# Altium schematic sheet SDcard_eMMC.SchDoc: SDcard_eMMC
size A3; Date: Not used; ApprovedBy: Not used; CheckedBy: Not used; Author: Not used; CompanyName: STMicroelectronics; DrawnBy: Not used; Engineer: Not used; Organization: Not used; Address1: Not used; Address2: Not used; Address3: Not used; Address4: Not used; DocumentNumber: Not used; Revision: Not used; SheetNumber: 13; SheetTotal: 18; CurrentTime: Not used; CurrentDate: Not used; Time: Not used; DocumentFullPathAndName: Not used; DocumentName: Not used; ModifiedDate: Not used; ImagePath: Not used; ProjectName: Not used; Application_BuildNumber: Not used
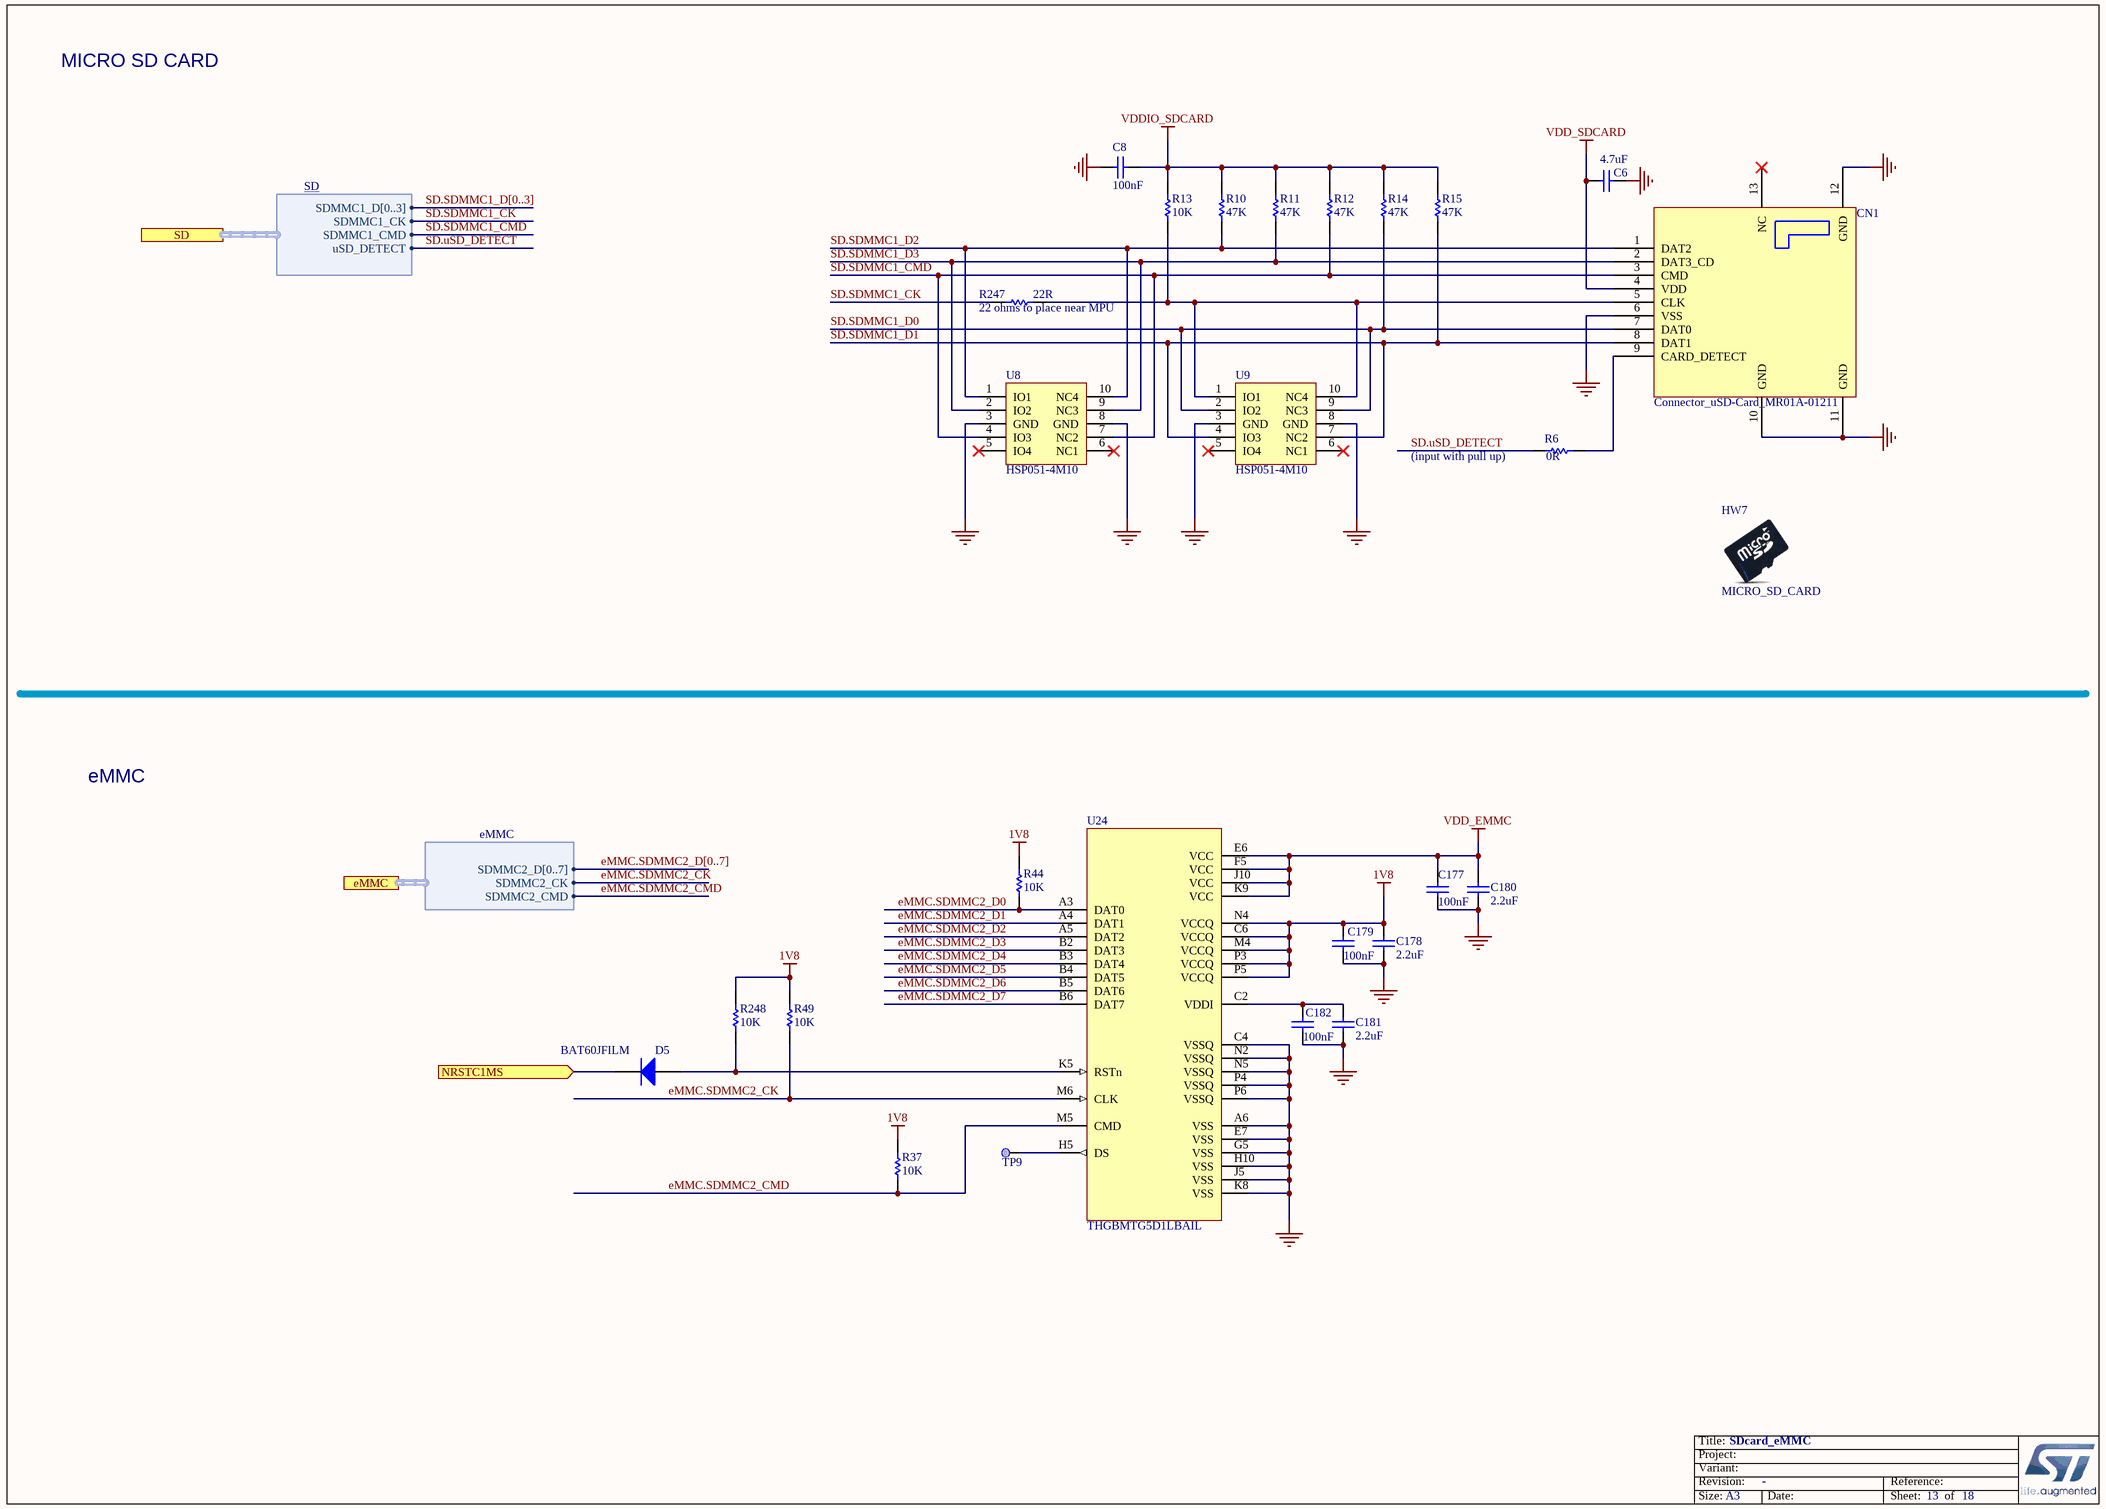
[diagram p0: SDcard_eMMC.SchDoc]

## Parts
C6  value 4.7uF  [C0402]  (hidden comment: Capacitor)
C8  value 100nF  [C0402]  (hidden comment: Capacitor)
C177  value 100nF  [C0402]  (hidden comment: Capacitor)
C178  value 2.2uF  [C0402]  (hidden comment: Capacitor)
C179  value 100nF  [C0402]  (hidden comment: Capacitor)
C180  value 2.2uF  [C0402]  (hidden comment: Capacitor)
C181  value 2.2uF  [C0402]  (hidden comment: Capacitor)
C182  value 100nF  [C0402]  (hidden comment: Capacitor)
CN1  value Connector_uSD-Card_MR01A-01211  [CON_MICROSD_ATOM_MR01A-01211]  (hidden comment: MR01A-01211)
D5  BAT60JFILM  [DIO_SOD323]
HW7  Micro_SD_card  (mechanical)
R6  value 0R  [R0402]  (hidden comment: Resistor)
R10  value 47K  [R0402]  (hidden comment: Resistor)
R11  value 47K  [R0402]  (hidden comment: Resistor)
R12  value 47K  [R0402]  (hidden comment: Resistor)
R13  value 10K  [R0402]  (hidden comment: Resistor)
R14  value 47K  [R0402]  (hidden comment: Resistor)
R15  value 47K  [R0402]  (hidden comment: Resistor)
R37  value 10K  [R0402]  (hidden comment: Resistor)
R44  value 10K  [R0402]  (hidden comment: Resistor)
R49  value 10K  [R0402]  (hidden comment: Resistor)
R247  value 22R  [R0201_H0P23]  (hidden comment: Resistor)
R248  value 10K  [R0402]  (hidden comment: Resistor)
TP9  Test Point  [TP_SMD_1MM]  (value not drawn)  (no BOM)
U8  HSP051-4M10  [ESD_UQFN-10L_2P5X1_P050]
U9  HSP051-4M10  [ESD_UQFN-10L_2P5X1_P050]
U24  value THGBMTG5D1LBAIL  [ICC_P-WFBGA153_13X11P5_P050]  (hidden comment: eMMC_THGBMTG5D1LBAIL)

## Ports
eMMC (harness eMMC), NRSTC1MS (in), SD (harness SD)

## Harnesses
SD: SDMMC1_D[0..3], SDMMC1_CK, SDMMC1_CMD, uSD_DETECT
eMMC: SDMMC2_CK, SDMMC2_CMD, SDMMC2_D[0..7]

## Nets
1V8: C178.2 C179.2 R37.2 R44.2 R49.2 R248.2 U24.C6(VCCQ) U24.M4(VCCQ) U24.N4(VCCQ) U24.P3(VCCQ) U24.P5(VCCQ)
GND: C6.1 C8.1 C177.1 C178.1 C179.1 C180.1 C181.1 C182.1 CN1.6(VSS) CN1.10(GND) CN1.11(GND) CN1.12(GND) U8.3(GND) U8.8(GND) U9.3(GND) U9.8(GND) U24.A6(VSS) U24.C4(VSSQ) U24.E7(VSS) U24.G5(VSS) U24.H10(VSS) U24.J5(VSS) U24.K8(VSS) U24.N2(VSSQ) U24.N5(VSSQ) U24.P4(VSSQ) U24.P6(VSSQ)
VDD_EMMC: C177.2 C180.2 U24.E6(VCC) U24.F5(VCC) U24.J10(VCC) U24.K9(VCC)
VDD_SDCARD: C6.2 CN1.4(VDD)
VDDIO_SDCARD: C8.2 R10.2 R11.2 R12.2 R13.2 R14.2 R15.2
eMMC.SDMMC2_CK: R49.1 U24.M6(CLK) ; port eMMC.SDMMC2_CK
eMMC.SDMMC2_CMD: R37.1 U24.M5(CMD) ; port eMMC.SDMMC2_CMD
eMMC.SDMMC2_D0: R44.1 U24.A3(DAT0)
eMMC.SDMMC2_D1: U24.A4(DAT1)
eMMC.SDMMC2_D2: U24.A5(DAT2)
eMMC.SDMMC2_D3: U24.B2(DAT3)
eMMC.SDMMC2_D4: U24.B3(DAT4)
eMMC.SDMMC2_D5: U24.B4(DAT5)
eMMC.SDMMC2_D6: U24.B5(DAT6)
eMMC.SDMMC2_D7: U24.B6(DAT7)
NRSTC1MS: D5.2(K) ; port NRSTC1MS
SD.SDMMC1_CK: R247.1 ; port SD.SDMMC1_CK
SD.SDMMC1_CMD: CN1.3(CMD) R12.1 U8.4(IO3) U8.7(NC2) ; port SD.SDMMC1_CMD
SD.SDMMC1_D0: CN1.7(DAT0) R14.1 U9.2(IO2) U9.9(NC3)
SD.SDMMC1_D1: CN1.8(DAT1) R15.1 U9.4(IO3) U9.7(NC2)
SD.SDMMC1_D2: CN1.1(DAT2) R10.1 U8.1(IO1) U8.10(NC4)
SD.SDMMC1_D3: CN1.2(DAT3_CD) R11.1 U8.2(IO2) U8.9(NC3)
SD.uSD_DETECT: R6.1 ; port SD.uSD_DETECT
NetC181_2: C181.2 C182.2 U24.C2(VDDI)
NetCN1_5: CN1.5(CLK) R13.1 R247.2 U9.1(IO1) U9.10(NC4)
NetCN1_9: CN1.9(CARD_DETECT) R6.2
NetD5_1: D5.1(A) R248.1 U24.K5(RSTn)
NetTP9_1: TP9.1 U24.H5(DS)

Not connected (* = marked no-connect by the designer): CN1 13(NC)*; U8 5(IO4)* 6(NC1)*; U9 5(IO4)* 6(NC1)*

## Buses and harness runs
bus eMMC.SDMMC2_D[0..7]
bus SD.SDMMC1_D[0..3]

## Notes on the sheet
- MICRO SD CARD
- (near R247) 22 ohms to place near MPU
- (near R6) (input with pull up)
- eMMC
- Title:
- Project:
- Size:
- Revision:
- Variant:
- A3
- -
- Date:
- Reference:
- Sheet:
- of

## Library data of the parts
C6 = MCD-01356: Capacitor, MLCC, 4.7uF, 6V3, X5R, 20%, 0402, T=0,5mm; Manufacturer_Part_Number: GRM155R60J475ME47; Manufacturer: MURATA; Alternate_Manufacturer_Part_Number: GRM155R60J475ME87; Part_Preference: Recommended; Provided_By: SUBCO; ECCN_EU: NEC; ECCN_US: EAR99; Order_Code_RS: 814-5230; Component_Country_Of_Origin: Japan; ID: 3456; ShowFields: YES; Internal_Part_Number: MCD-01356; Status: Released; Part_Type: Capacitor; Package: 0402; ComponentLink1Description: Datasheet; ComponentLink1URL: http://tunmcdsvn.tun.st.com/Component_Documentation_Library/Trunk/Capacitor/MURATA_GRM_Series; Alternate_Manufacturer: MURATA; Order_Code_Digikey: 490-5915-1-ND; Order_Code_Farnell: 2666407
C8 C177 C179 C182 = MCD-00006: Capacitor, MLCC, 100nF, 16V, X7R, +/-10%, 0402, T=0.5mm; Part_Preference: Recommended; Manufacturer: YAGEO; Manufacturer_Part_Number: CC0402KRX7R7BB104; Alternate_Manufacturer: MURATA; Alternate_Manufacturer_Part_Number: GCM155R71C104KA55D; Order_Code_RS: 616-9701; Component_Country_Of_Origin: China; ID: 2474; ShowFields: YES; Internal_Part_Number: MCD-00006; Status: Released; Part_Type: Capacitor; Package: 0402; ComponentLink1Description: Datasheet; ComponentLink1URL: http://tunmcdsvn.tun.st.com/Component_Documentation_Library/Trunk/Capacitor/YAGEO_X7R_Series; Order_Code_Digikey: 311-1338-1-ND; Order_Code_Farnell: 9402047
C178 C180 C181 = MCD-02606: Capacitor, MLCC, 2.2uF, 6.3V, X5R, +/-10%, 0402, T=0.5mm; Part_Preference: Recommended; Manufacturer: YAGEO; Manufacturer_Part_Number: CC0402KRX5R5BB225; Order_Code_RS: 1992205; ShowFields: YES; ID: 4712; Internal_Part_Number: MCD-02606; Status: New; Part_Type: Capacitor; Package: 0402; ComponentLink1URL: http://tunmcdsvn.tun.st.com/Component_Documentation_Library/Trunk/Capacitor/YAGEO_X5R_Series; Order_Code_Digikey: 311-1682-2-ND; Order_Code_Farnell: 3366429
CN1 = MCD-00653: Connector_uSD Card, Top Mnt Push-Push; Part_Preference: Recommended; Manufacturer: ATOM; Component_Country_Of_Origin: Unknown; ShowFields: YES; ID: 3087; Internal_Part_Number: MCD-00653; Status: Released; Part_Type: Connector; Manufacturer_Part_Number: MR01A-01211; ComponentLink1URL: http://tunmcdsvn.tun.st.com/Component_Documentation_Library/Trunk/Connector/ATOM_MR01A-01211/; Order_Code_Digikey: N/A; Order_Code_Farnell: N/A; Order_Code_RS: N/A
D5 = MCD-00034: BMS_Part_Number: 9151097; Part_Type: Diode; Part_Preference: Recommended; Manufacturer: STMICROELECTRONICS; Manufacturer_HQ_COO: EU; Component_Country_Of_Origin: China; ShowFields: YES; ID: 2483; Internal_Part_Number: MCD-00034; Value: BAT60JFILM; Status: Released; Manufacturer_Part_Number: BAT60JFILM; ComponentLink1URL: http://tunmcdsvn.tun.st.com/Component_Datasheet_Library/Trunk/Diodes/STM_Diode_BAT60JFILM-SOD323
HW7 = MCD-03307: MICRO_SD_CARD, SANDISK, 16GB, Class10, 3V; Part_Type: Mechanical; Part_Preference: Recommended; Manufacturer_Part_Number: SDSDQAD-016G; Order_Code_RS: 220-8618; ShowFields: YES; ID: 5423; Internal_Part_Number: MCD-03307; Value: MICRO_SD_CARD; Status: New; Manufacturer: SANDISK; Package: N/A; ComponentLink1URL: http://tunmcdsvn.tun.st.com/Component_Documentation_Library/Trunk/Mechanical/SANDISK_SDSDQAD-016G; Order_Code_Digikey: N/A; Order_Code_Farnell: N/A
R6 = MCD-00052: Resistor,0R,0402,5%,1/16W; Manufacturer_Part_Number: RC0402JR-070RL; Manufacturer: YAGEO; Part_Preference: Recommended; ECCN_US: EAR99; ECCN_EU: NEC; Provided_By: SUBCO; Order_Code_RS: 618-5804; Component_Country_Of_Origin: China; ID: 2540; ShowFields: YES; Internal_Part_Number: MCD-00052; ComponentLink1Description: Datasheet; Status: Released; Part_Type: Resistor; ComponentLink1URL: http://tunmcdsvn.tun.st.com/Component_Documentation_Library/Trunk/Resistor/YAGEO_RC_L_Series; Package: 0402; Alternate_Manufacturer: N/A; Alternate_Manufacturer_Part_Number: N/A; Order_Code_Digikey: 311-0.0JRCT-ND; Order_Code_Farnell: 9232516RL
R10-R12 R14 R15 = MCD-00063: Resistor,47K,0402,1%,1/16W; Manufacturer_Part_Number: RC0402FR-0747KL; Manufacturer: YAGEO; Part_Preference: Recommended; ECCN_US: EAR99; ECCN_EU: NEC; Provided_By: SUBCO; Component_Country_Of_Origin: China; ID: 2528; ShowFields: YES; Internal_Part_Number: MCD-00063; ComponentLink1Description: Datasheet; Status: Released; Part_Type: Resistor; ComponentLink1URL: http://tunmcdsvn.tun.st.com/Component_Documentation_Library/Trunk/Resistor/YAGEO_RC_L_Series; Package: 0402; Alternate_Manufacturer: N/A; Alternate_Manufacturer_Part_Number: N/A; Order_Code_Digikey: 311-47.0KLRCT-ND; Order_Code_Farnell: 9239430; Order_Code_RS: N/A
R13 R37 R44 R49 R248 = MCD-00053: Resistor,10K,0402,1%,1/16W; Manufacturer_Part_Number: RC0402FR-0710KL; Manufacturer: YAGEO; BMS_Part_Number: 9131590; Part_Preference: Recommended; ECCN_US: EAR99; ECCN_EU: NEC; Provided_By: SUBCO; Component_Country_Of_Origin: China; ID: 2539; ShowFields: YES; Internal_Part_Number: MCD-00053; ComponentLink1Description: Datasheet; Status: Released; Part_Type: Resistor; ComponentLink1URL: http://tunmcdsvn.tun.st.com/Component_Documentation_Library/Trunk/Resistor/YAGEO_RC_L_Series; Package: 0402; Order_Code_Digikey: 311-10.0KLRCT-ND; Order_Code_Farnell: 9239359; Order_Code_RS: N/A
  R13: Alternate_Manufacturer: N/A; Alternate_Manufacturer_Part_Number: N/A
R247 = MCD-02978: Resistor, 22R, 0201, +/-1%, 1/20W; Manufacturer_Part_Number: RC0201FR-0722RL; Manufacturer: YAGEO; Part_Preference: Recommended; Order_Code_RS: 198-7593; ID: 5094; ShowFields: YES; Internal_Part_Number: MCD-02978; Status: New; Part_Type: Resistor; ComponentLink1URL: http://tunmcdsvn.tun.st.com/Component_Documentation_Library/Trunk/Resistor/YAGEO_RC_L_Series; Package: 0201; Order_Code_Digikey: YAG2518TR-ND; Order_Code_Farnell: 2693564
TP9 = MCD-00074: Test Point 1mm; Part_Type: Misc; Part_Preference: Recommended; ID: 2518; ShowFields: YES; Internal_Part_Number: MCD-00074; Status: Released; Manufacturer_Part_Number: n/a; Manufacturer: n/a; ComponentLink1Description: Datasheet; ComponentLink1URL: http://na; ECCN_US: n/a; ECCN_EU: n/a; Provided_By: n/a; Order_Code_Digikey: N/A; Order_Code_Farnell: N/A; Order_Code_RS: N/A
U8 U9 = MCD-00667: 4-line ESD protection for high speed lines; Part_Type: Diode; Manufacturer: STMICROELECTRONICS; BMS_Part_Number: 9179041; Manufacturer_HQ_COO: EU; Part_Preference: Recommended; ECCN_US: EAR99; ECCN_EU: NEC; Provided_By: SUBCO with ST control; Component_Country_Of_Origin: Philippines; ID: 3081; ShowFields: YES; Internal_Part_Number: MCD-00667; Value: HSP051-4M10; Status: Released; Manufacturer_Part_Number: HSP051-4M10; Package: uQFN-10L; ComponentLink1Description: Datasheet; ComponentLink1URL: http://tunmcdsvn.tun.st.com/Component_Datasheet_Library/Trunk/Diodes/STM_ESD_HSP051-4M10
U24 = MCD-02799: Memory, eMMC, 4GB, 15nm ,WFBGA , 153 pins; Part_Type: IC; Part_Preference: Recommended; Manufacturer: KIOXIA; ShowFields: YES; ID: 4911; Internal_Part_Number: MCD-02799; Status: New; Manufacturer_Part_Number: THGBMTG5D1LBAIL; Package: WFBGA153; ComponentLink1URL: http://tunmcdsvn.tun.st.com/Component_Documentation_Library/Trunk/IC/KIOXIA_THGBMTG5D1LBAIL; Order_Code_Digikey: N/A; Order_Code_Farnell: N/A; Order_Code_RS: N/A